# Altium schematic sheet ACPowerDistributionACtoDC.SchDoc
size A; SheetNumber: 2; SheetTotal: 5
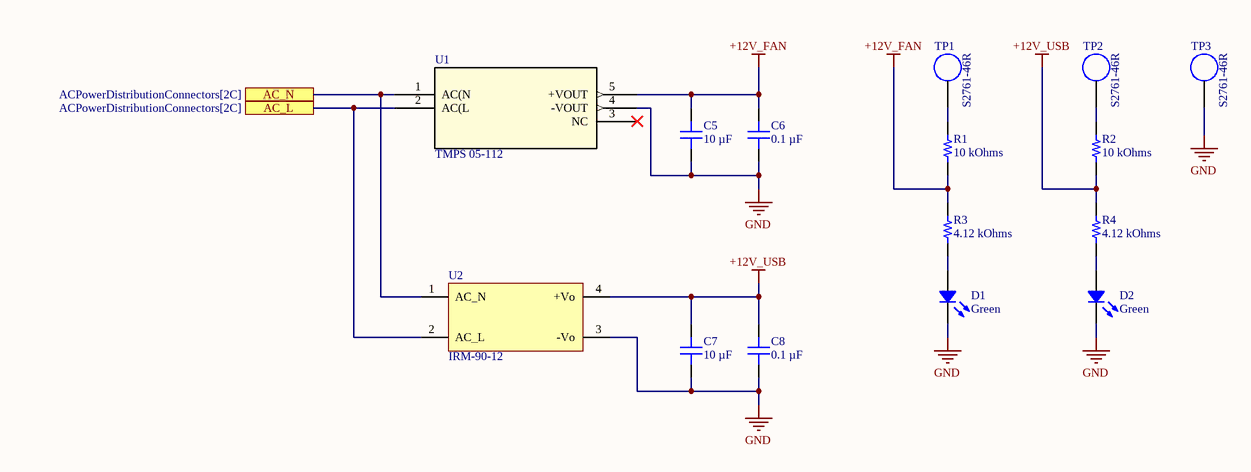
[diagram p0: ACPowerDistributionACtoDC.SchDoc]

## Parts
C5  10 µF  [CAP 1210_3225 - 1MM]
C6  0.1 µF  [CAP 0603_1608]
C7  10 µF  [CAP 1210_3225 - 1MM]
C8  0.1 µF  [CAP 0603_1608]
D1  Green  [LED 0603_1608 GREEN]
D2  Green  [LED 0603_1608 GREEN]
R1  10 kOhms  [RES 0603_1608]
R2  10 kOhms  [RES 0603_1608]
R3  4.12 kOhms  [RES 0603_1608]
R4  4.12 kOhms  [RES 0603_1608]
TP1  S2761-46R  [S2761-46R]
TP2  S2761-46R  [S2761-46R]
TP3  S2761-46R  [S2761-46R]
U1  TMPS 05-112  [TMPS05_TRP]
U2  IRM-90-12  [IRM-90-12]

## Ports
AC_L (see ACPowerDistributionConnectors[2C]), AC_N (see ACPowerDistributionConnectors[2C])

## Nets
+12V_FAN: C5.2 C6.2 R1.1 R3.2 U1.5(+VOUT)
+12V_USB: C7.2 C8.2 R2.1 R4.2 U2.4(+Vo)
GND: C5.1 C6.1 C7.1 C8.1 D1.2 D2.2 TP3.1 U1.4(-VOUT) U2.3(-Vo)
AC_L: U1.2(AC(L) U2.2(AC_L) ; port AC_L
AC_N: U1.1(AC(N) U2.1(AC_N) ; port AC_N
NetD1_1: D1.1 R3.1
NetD2_1: D2.1 R4.1
NetR1_2: R1.2 TP1.1
NetR2_2: R2.2 TP2.1

Not connected (* = marked no-connect by the designer): U1 3(NC)*

## Library data of the parts
C5 C7 = CGA6P1X7R1N106K250AC: CAP CER 10UF 75V X7R 1210; manufacturer: TDK Corporation; Tolerance: ±10%; Part Number: CGA6P1X7R1N106K250AC; Value: 10 µF; Applications: Automotive; Capacitance: 10 µF; componentlink1description: Datasheet; componentlink1url: https://product.tdk.com/info/en/catalog/datasheets/mlcc_automotive_general_en.pdf?ref_disty=digikey; componentlink2description: DigiKey Link; componentlink2url: https://www.digikey.com/en/products/detail/tdk-corporation/CGA6P1X7R1N106K250AC/10240635; Device Package: 1210 (3225 Metric); lastupdated: 6/4/2024 7:21:00 PM; Lifecycle Status: Active; Minimum Order: 1; Mounting Type: Surface Mount, MLCC; Operating Temperature: -55°C ~ 125°C; Package / Case: 1210 (3225 Metric); packaging: TapeAndReel; partid: 40572; Part Status: Active; price: 0.30; series: CGA; Size / Dimension: 0.126" L x 0.098" W (3.20mm x 2.50mm); Supplier 1: DigiKey; Supplier Part Number 1: 445-181658-1-ND; Temperature Coefficient: X7R; Thickness (Max): 0.110" (2.80mm); Voltage - Rated: 75V; Features: Low ESL; Ratings: AEC-Q200
C6 C8 = CL10B104KA8WPNC: CAP CER 0.1UF 25V X7R 0603; manufacturer: Samsung Electro-Mechanics; Tolerance: ±10%; Part Number: CL10B104KA8WPNC; Capacitance: 0.1 µF; Applications: Automotive; componentlink1description: Datasheet; componentlink1url: http://www.samsungsem.com/kr/support/product-search/mlcc/CL10B104KA8WPNC.jsp; componentlink2description: DigiKey Link; componentlink2url: https://www.digikey.com/en/products/detail/samsung-electro-mechanics/CL10B104KA8WPNC/5961201; Device Package: 0603 (1608 Metric); Features: Open Mode; lastupdated: 2/9/2024 8:10:26 PM; Lifecycle Status: Active; Minimum Order: 1; Mounting Type: Surface Mount, MLCC; Operating Temperature: -55°C ~ 125°C; Package / Case: 0603 (1608 Metric); packaging: TapeAndReel; partid: 5631; Part Status: Active; price: 0.01; Ratings: AEC-Q200; series: CL; Size / Dimension: 0.063" L x 0.031" W (1.60mm x 0.80mm); Supplier 1: DigiKey; Supplier Part Number 1: 1276-6717-1-ND; Temperature Coefficient: X7R; Thickness (Max): 0.035" (0.90mm); value: 0.1 µF; Voltage - Rated: 25V
D1 D2 = 150060VS75020: LED GREEN CLEAR 0603 SMD; Manufacturer: Würth Elektronik; Configuration: Independent; Current - Test: 20mA; Lens Color: Colorless; Lens Size: 1.10mm x 0.80mm; Lens Style: Rectangle with Flat Top; Millicandela Rating: 50mcd; Viewing Angle: 140°; Voltage - Forward (Vf) (Typ): 2V; Wavelength - Dominant: 570nm; Wavelength - Peak: 572nm; Part Number: 150060VS75020; Color: Green; ComponentLink2Description: DigiKey Link; ComponentLink2URL: https://www.digikey.com/en/products/detail/würth-elektronik/150060VS75020/10468264; Device Package: 0603 (1608 Metric); Height (Max): 0.45mm; LastUpdated: 8/25/2025 8:35:25 PM; Lens Transparency: Clear; Lifecycle Status: Active; Minimum Order: 1; Mounting Type: Surface Mount; Package / Case: 0603 (1608 Metric); Packaging: TapeAndReel; PartId: 588; Part Status: Active; Price: 0.17; Series: WL-SMCW; Size / Dimension: 1.60mm L x 0.80mm W; Supplier 1: DigiKey; Supplier Part Number 1: 732-150060VS75020CT-ND; Supplier Device Package: 0603; Value: Green
R1 R2 = RMCF0603FT10K0: RES 10K OHM 1% 1/10W 0603; Manufacturer: Stackpole Electronics Inc; Power (Watts): 0.1W, 1/10W; Temperature Coefficient: ±100ppm/°C; Part Number: RMCF0603FT10K0; Value: 10 kOhms; ComponentLink1Description: Datasheet; ComponentLink1URL: https://www.seielect.com/catalog/sei-rmcf_rmcp.pdf; ComponentLink2Description: DigiKey Link; ComponentLink2URL: https://www.digikey.com/en/products/detail/stackpole-electronics-inc/RMCF0603FT10K0/1761235; Composition: Thick Film; Device Package: 0603 (1608 Metric); Features: Automotive AEC-Q200; Height - Seated (Max): 0.022" (0.55mm); LastUpdated: 2/9/2024 8:42:00 PM; Lifecycle Status: Active; Minimum Order: 1; Number of Terminations: 2; Operating Temperature: -55°C ~ 155°C; Package / Case: 0603 (1608 Metric); Packaging: CutTape; PartId: 25663; Part Status: Active; Price: 0.01; Ratings: AEC-Q200; Resistance: 10 kOhms; Series: RMCF; Size / Dimension: 0.061" L x 0.031" W (1.55mm x 0.80mm); Supplier 1: DigiKey; Supplier Part Number 1: RMCF0603FT10K0CT-ND; Supplier Device Package: 0603; Tolerance: ±1%
R3 R4 = RMCF0603FT4K12: RES 4.12K OHM 1% 1/10W 0603; Manufacturer: Stackpole Electronics Inc; Power (Watts): 0.1W, 1/10W; Temperature Coefficient: ±100ppm/°C; Part Number: RMCF0603FT4K12; Value: 4.12 kOhms; ComponentLink1Description: Datasheet; ComponentLink1URL: https://www.seielect.com/catalog/sei-rmcf_rmcp.pdf; ComponentLink2Description: DigiKey Link; ComponentLink2URL: https://www.digikey.com/en/products/detail/stackpole-electronics-inc/RMCF0603FT4K12/1713994; Composition: Thick Film; Device Package: 0603 (1608 Metric); Features: Automotive AEC-Q200; Height - Seated (Max): 0.022" (0.55mm); LastUpdated: 2/9/2024 8:42:56 PM; Lifecycle Status: Active; Minimum Order: 1; Number of Terminations: 2; Operating Temperature: -55°C ~ 155°C; Package / Case: 0603 (1608 Metric); Packaging: CutTape; PartId: 15250; Part Status: Active; Price: 0.01; Ratings: AEC-Q200; Resistance: 4.12 kOhms; Series: RMCF; Size / Dimension: 0.061" L x 0.031" W (1.55mm x 0.80mm); Supplier 1: DigiKey; Supplier Part Number 1: RMCF0603FT4K12CT-ND; Supplier Device Package: 0603; Tolerance: ±1%
U1 = CMP-01539-65687566-1: TMPS 05-112 AC/DC Power Supply Single-OUT 12V 0.416A 5W 5-Pin; Number of Outputs: 1; Efficiency: 81%; Output Current: 540mA; Min Operating Temperature: -25°C; Width: 25.4mm; Output Voltage: 12V; Power Rating: 5W; Height: 16.3mm; Length: 25.4mm; RoHS: Non-Compliant; NexarPartId: 65687566; Output Power: 5W; Max Operating Temperature: 70°C; Depth: 15.3mm
TP1-TP3 = S2761-46R: Supplier 1: DigiKey; Supplier Part Number 1: 952-2665-1-ND
U2 = IRM-90-12: Supplier 1: RS (Formerly Allied Electronics); Supplier Part Number 1: 71939990